# Altium schematic sheet nRF52_UWB_MPU_MPU.schdoc
size 316 x 224 mm
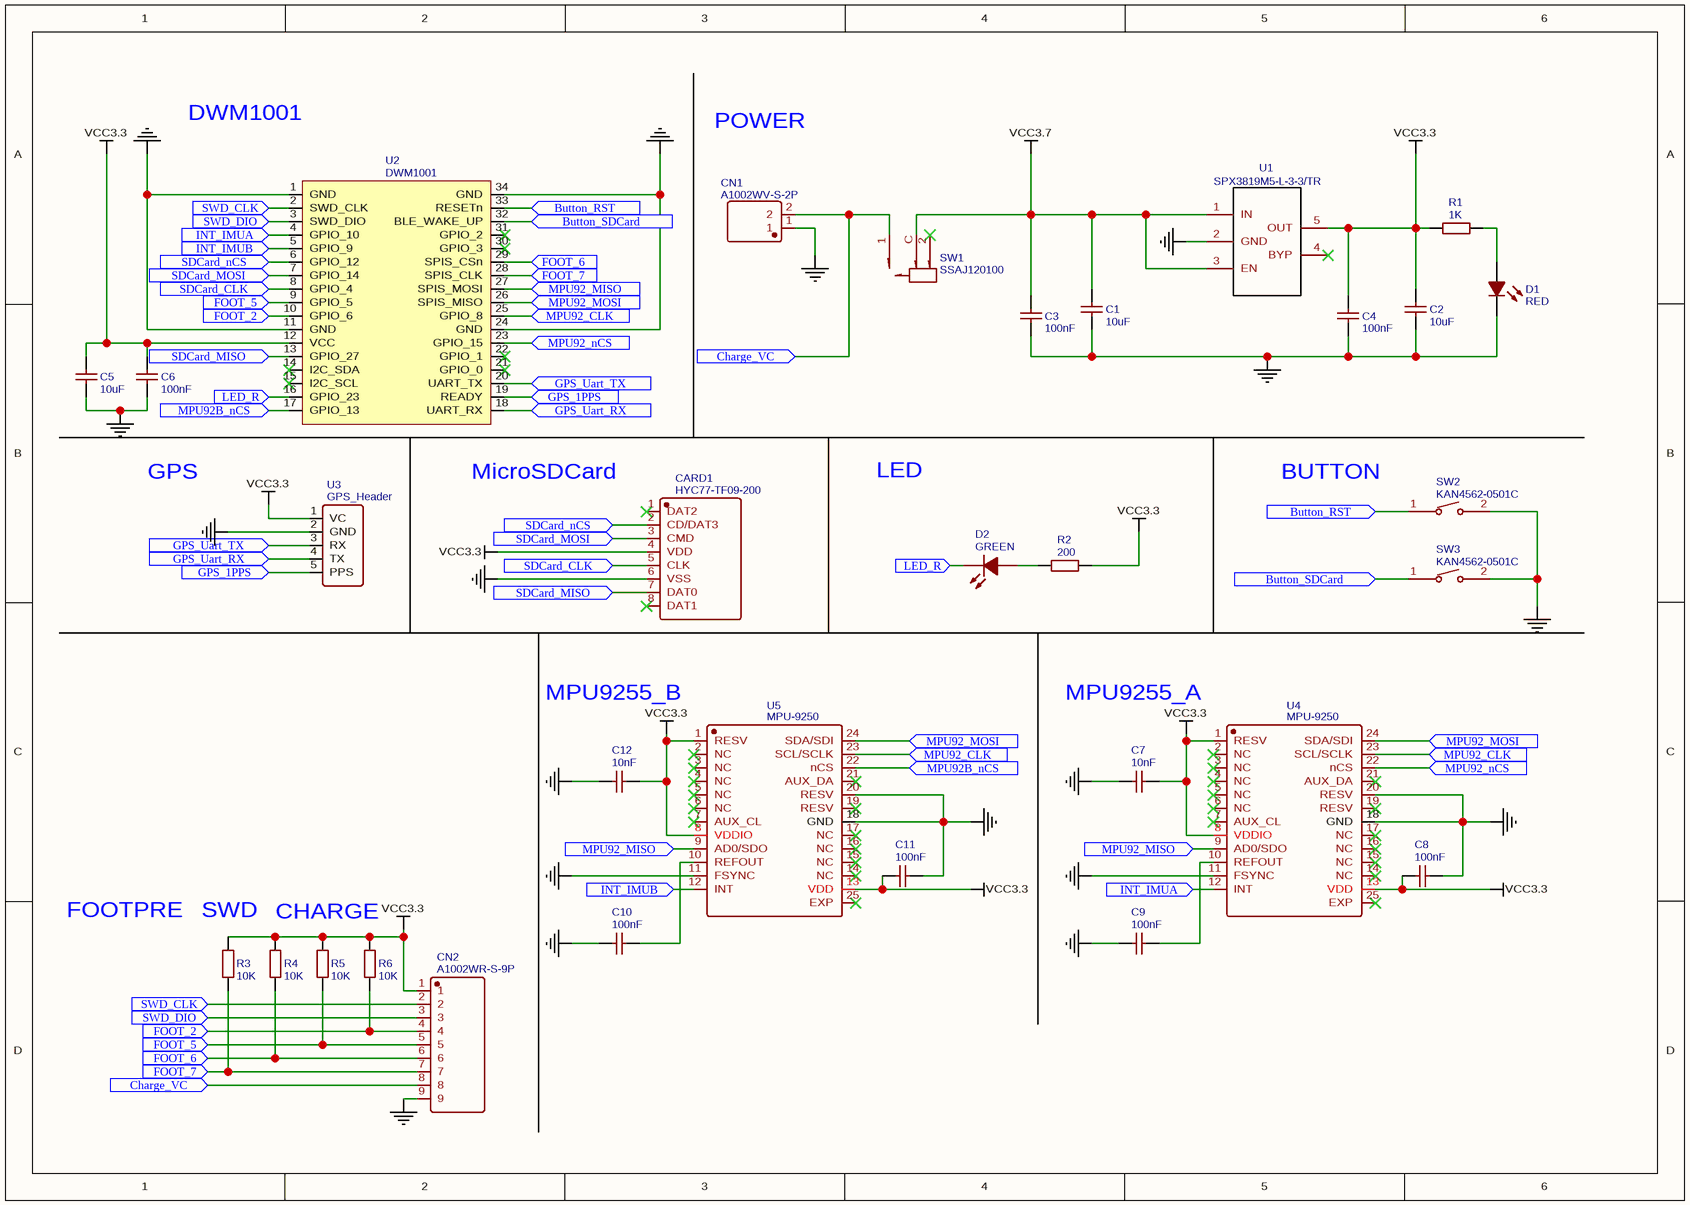
[diagram p0: nRF52_UWB_MPU_MPU.schdoc]

## Parts
C1  10uF  [0402]
C2  10uF  [0402]
C3  100nF  [0402]
C4  100nF  [0402]
C5  10uF  [0402]
C6  100nF  [0402]
C7  10nF  [0402]
C8  100nF  [0402]
C9  100nF  [0402]
C10  100nF  [0402]
C11  100nF  [0402]
C12  10nF  [0402]
CARD1  HYC77-TF09-200  [TF-015]
CN1  A1002WV-S-2P  [A1002WR-S-2P_LEO]
CN2  A1002WR-S-9P  [A1002WR-S-9P_LEO]
D1  RED  [LED-0603]
D2  GREEN  [LED-0603]
R1  1K  [0402]
R2  200  [0402]
R3  10K  [0402]
R4  10K  [0402]
R5  10K  [0402]
R6  10K  [0402]
SW1  SSAJ120100  [SW-SMD-5.5X2.5]
SW2  KAN4562-0501C  [KAN4562-0501C]
SW3  KAN4562-0501C  [KAN4562-0501C]
U1  SPX3819M5-L-3-3/TR  [SOT-23-5]
U2  DWM1001  [DWM1001]
U3  GPS_Header  [GPS_HEADER_SMT_NEW]
U4  MPU-9250  [QFN-24-1EP_3X3MM_PITCH0.4MM]
U5  MPU-9250  [QFN-24-1EP_3X3MM_PITCH0.4MM]

## Ports
Button_RST, Button_SDCard, Charge_VC, FOOT_2, FOOT_5, FOOT_6, FOOT_7, GPS_1PPS, GPS_Uart_RX, GPS_Uart_TX, INT_IMUA, INT_IMUB, LED_R, MPU92_CLK, MPU92_MISO, MPU92_MOSI, MPU92_nCS, MPU92B_nCS, SDCard_CLK, SDCard_MISO, SDCard_MOSI, SDCard_nCS, SWD_CLK, SWD_DIO

## Nets
GND: C1.1 C2.1 C3.1 C4.1 C5.1 C6.1 C7.1 C8.1 C9.2 C10.2 C11.1 C12.1 CARD1.6(VSS) CN1.1 CN2.9 D1.2(C) SW2.2 SW3.2 U1.2(GND) U2.1(GND) U2.11(GND) U2.24(GND) U2.34(GND) U3.2(GND) U4.11(FSYNC) U4.18(GND) U4.20(RESV) U5.11(FSYNC) U5.18(GND) U5.20(RESV)
VCC3.3: C2.2 C4.2 C5.2 C6.2 C7.2 C8.2 C11.2 C12.2 CARD1.4(VDD) CN2.1 R1.1 R2.2 R3.2 R4.2 R5.2 R6.2 U1.5(OUT) U2.12(VCC) U3.1(VC) U4.1(RESV) U4.8(VDDIO) U4.13(VDD) U5.1(RESV) U5.8(VDDIO) U5.13(VDD)
VCC3.7: C1.2 C3.2 SW1.C U1.1(IN) U1.3(EN)
Button_RST: SW2.1 U2.33(RESETn) ; port Button_RST
Button_SDCard: SW3.1 U2.32(BLE_WAKE_UP) ; port Button_SDCard
Charge_VC: CN1.2 CN2.8 SW1.1 ; port Charge_VC
FOOT_2: CN2.2 CN2.4 CN2.6 R4.1 R6.1 U2.2(SWD_CLK) U2.10(GPIO_6) U2.29(SPIS_CSn) ; port SWD_CLK, port FOOT_2, port FOOT_6
FOOT_5: CN2.3 CN2.5 CN2.7 R3.1 R5.1 U2.3(SWD_DIO) U2.9(GPIO_5) U2.28(SPIS_CLK) ; port SWD_DIO, port FOOT_5, port FOOT_7
GPS_1PPS: U2.19(READY) U3.5(PPS) ; port GPS_1PPS
GPS_Uart_RX: U2.18(UART_RX) U3.4(TX) ; port GPS_Uart_RX
GPS_Uart_TX: U2.20(UART_TX) U3.3(RX) ; port GPS_Uart_TX
INT_IMUA: U2.4(GPIO_10) U4.12(INT) ; port INT_IMUA
INT_IMUB: U2.5(GPIO_9) U5.12(INT) ; port INT_IMUB
LED_R: D2.2(K) U2.16(GPIO_23) ; port LED_R
MPU92_CLK: U2.25(GPIO_8) U4.23(SCL/SCLK) U5.23(SCL/SCLK) ; port MPU92_CLK
MPU92_MISO: U2.27(SPIS_MOSI) U4.9(AD0/SDO) U5.9(AD0/SDO) ; port MPU92_MISO
MPU92_MOSI: U2.26(SPIS_MISO) U4.24(SDA/SDI) U5.24(SDA/SDI) ; port MPU92_MOSI
MPU92_nCS: U2.23(GPIO_15) U4.22(nCS) ; port MPU92_nCS
MPU92B_nCS: U2.17(GPIO_13) U5.22(nCS) ; port MPU92B_nCS
SDCard_CLK: CARD1.5(CLK) U2.8(GPIO_4) ; port SDCard_CLK
SDCard_MISO: CARD1.7(DAT0) U2.13(GPIO_27) ; port SDCard_MISO
SDCard_MOSI: CARD1.3(CMD) U2.7(GPIO_14) ; port SDCard_MOSI
SDCard_nCS: CARD1.2(CD/DAT3) U2.6(GPIO_12) ; port SDCard_nCS
NetC9_1: C9.1 U4.10(REFOUT)
NetC10_1: C10.1 U5.10(REFOUT)
NetD1_1: D1.1(A) R1.2
NetD2_1: D2.1(A) R2.1

Not connected (* = marked no-connect by the designer): CARD1 1(DAT2)* 8(DAT1)*; SW1 2*; U1 4(BYP)*; U2 14(I2C_SDA)* 15(I2C_SCL)* 21(GPIO_0)* 22(GPIO_1)* 30(GPIO_3)* 31(GPIO_2)*; U4 2(NC)* 3(NC)* 4(NC)* 5(NC)* 6(NC)* 7(AUX_CL)* 14(NC)* 15(NC)* 16(NC)* 17(NC)* 19(RESV)* 21(AUX_DA)* 25(EXP)*; U5 2(NC)* 3(NC)* 4(NC)* 5(NC)* 6(NC)* 7(AUX_CL)* 14(NC)* 15(NC)* 16(NC)* 17(NC)* 19(RESV)* 21(AUX_DA)* 25(EXP)*

## Notes on the sheet
- DWM1001
- POWER
- GPS
- MicroSDCard
- LED
- BUTTON
- MPU9255_B
- MPU9255_A
- FOOTPRE
- (near R3) SWD
- CHARGE

## Library data of the parts
C1 C2 C5 = 10uF: BOM_Manufacturer Part: CL05A106MQ5NUNC; BOM_Manufacturer: SAMSUNG; nameAlias: Capacitance; BOM_Supplier: LCSC; BOM_LCSC Assembly: Yes; BOM_Supplier Part: C15525; spicePre: C; spiceSymbolName: CL05A106MQ5NUNC
C3 C4 C6 C8-C11 = 100nF: BOM_Manufacturer Part: CL05B104KO5NNNC; BOM_Manufacturer: SAMSUNG; nameAlias: Capacitance; BOM_Supplier: LCSC; BOM_LCSC Assembly: Yes; BOM_Supplier Part: C1525; spicePre: C; spiceSymbolName: CL05B104KO5NNNC
C7 C12 = 10nF: BOM_Manufacturer Part: CL05B103KB5NNNC; BOM_Manufacturer: SAMSUNG; nameAlias: Capacitance; BOM_Supplier: LCSC; BOM_LCSC Assembly: Yes; BOM_Supplier Part: C15195; spicePre: C; spiceSymbolName: CL05B103KB5NNNC
CARD1 = HYC77-TF09-200: BOM_Manufacturer: 华宇创; Contributor: LCSC; BOM_Supplier: LCSC; BOM_Supplier Part: C341092; BOM_Manufacturer Part: HYC77-TF09-200; spicePre: C
CN1 = A1002WV-S-2P: BOM_Manufacturer: Changjiang Connectors; BOM_Manufacturer Part: A1002WR-S-2P; Contributor: LCSC; BOM_Supplier: LCSC; BOM_Supplier Part: C239520; spicePre: C
CN2 = A1002WR-S-9P: BOM_Manufacturer: Changjiang Connectors; Contributor: LCSC; BOM_Supplier: LCSC; BOM_Supplier Part: C239527; BOM_Manufacturer Part: A1002WR-S-9P; spicePre: C
D1 = RED: BOM_Manufacturer: EVERLIGHT; BOM_Manufacturer Part: 19-213/Y2C-CQ2R2L/3T(CY); BOM_Supplier: LCSC; BOM_LCSC Assembly: Yes; image: //image.lceda.cn/szlcsc/C72038.jpg; BOM_Supplier Part: C2286; spicePre: L
D2 = GREEN: BOM_Manufacturer: KENTO; BOM_Manufacturer Part: KT-0603R; BOM_Supplier: LCSC; BOM_LCSC Assembly: Yes; image: //image.lceda.cn/szlcsc/C2286.jpg; BOM_Supplier Part: C72043; spicePre: L
R1 = 1K: BOM_Manufacturer: UniOhm; BOM_Manufacturer Part: 0402WGF1001TCE; nameAlias: Resistance (Ohms); BOM_Supplier: LCSC; BOM_LCSC Assembly: Yes; BOM_Supplier Part: C11702; spicePre: R; spiceSymbolName: 0402WGF1001TCE
R2 = 200: BOM_Manufacturer: UniOhm; BOM_Manufacturer Part: 0402WGF2000TCE; nameAlias: Resistance (Ohms); BOM_Supplier: LCSC; BOM_LCSC Assembly: Yes; BOM_Supplier Part: C25087; spicePre: R; spiceSymbolName: 0402WGF2000TCE
R3-R6 = 10K: BOM_Manufacturer: UniOhm; BOM_Manufacturer Part: 0402WGF1002TCE; nameAlias: Resistance (Ohms); BOM_Supplier: LCSC; BOM_LCSC Assembly: Yes; BOM_Supplier Part: C25744; spicePre: R; spiceSymbolName: 0402WGF1002TCE
SW1 = SSAJ120100: BOM_Manufacturer: ALPS Electric; Contributor: LCSC; BOM_Supplier: LCSC; BOM_Supplier Part: C160864; BOM_Manufacturer Part: SSAJ120100; spicePre: S
SW2 SW3 = KAN4562-0501C: BOM_Manufacturer: GANGYUAN; Contributor: LCSC; BOM_Supplier: LCSC; BOM_Supplier Part: C231728; BOM_Manufacturer Part: KAN4562-0501C; spicePre: S
U1 = SPX3819M5-L-3-3/TR: BOM_Manufacturer: EXAR; BOM_Supplier: LCSC; BOM_Manufacturer Part: SPX3819M5-L-3-3/TR; image: //image.lceda.cn/szlcsc/C9055.jpg; BOM_Supplier Part: C9055; spicePre: U
U2 = DWM1001: Contributor: wangcbYY; BOM_Manufacturer Part: ?; spicePre: U
U3 = GPS_Header: Contributor: wangcbYY; BOM_Manufacturer Part: ?; spicePre: U
U4 U5 = MPU-9250: BOM_Manufacturer: InvenSense; Contributor: LCSC; BOM_Supplier: LCSC; BOM_Manufacturer Part: MPU-9250; BOM_Supplier Part: C71459; spicePre: U